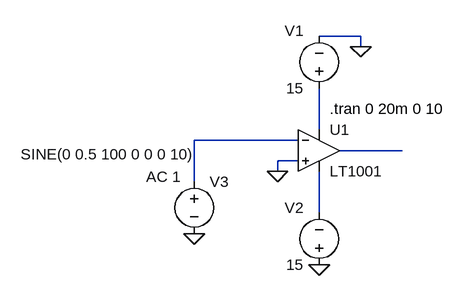
[diagram p0: schematic LT1001_lab2_q3c.asc]
LT1001_lab2_q3c.asc, the LTspice schematic file:
Version 4
SHEET 1 880 680
WIRE 192 96 128 96
WIRE 192 112 192 96
WIRE 128 240 128 176
WIRE 96 256 -64 256
WIRE 256 272 160 272
WIRE 96 288 64 288
WIRE 64 304 64 288
WIRE -64 320 -64 256
WIRE 128 368 128 304
FLAG 192 112 0
FLAG 128 448 0
FLAG -64 400 0
FLAG 64 304 0
SYMBOL Opamps\\LT1001 128 208 R0
SYMATTR InstName U1
SYMBOL voltage 128 192 R180
WINDOW 0 24 104 Left 0
WINDOW 3 24 16 Left 0
WINDOW 123 0 0 Left 0
WINDOW 39 0 0 Left 0
SYMATTR InstName V1
SYMATTR Value 15
SYMBOL voltage 128 464 R180
WINDOW 0 24 104 Left 0
WINDOW 3 24 16 Left 0
WINDOW 123 0 0 Left 0
WINDOW 39 0 0 Left 0
SYMATTR InstName V2
SYMATTR Value 15
SYMBOL voltage -64 304 R0
WINDOW 3 -267 -26 Left 0
WINDOW 123 -74 8 Left 0
WINDOW 39 0 0 Left 0
SYMATTR Value SINE(0 0.5 100 0 0 0 10)
SYMATTR Value2 AC 1
SYMATTR InstName V3
TEXT 144 208 Left 0 !.tran 0 20m 0 10

The netlist it stands for:
* LT1001_lab2_q3c.asc
XU1 0 N002 N001 N004 N003 LT1001  ; pins In+ In- V+ V- OUT
V1 N001 0 15
V2 0 N004 15
V3 N002 0 SINE(0 0.5 100 0 0 0 10) AC 1
.tran 0 20m 0 10
.lib LTC.lib
.backanno
.end